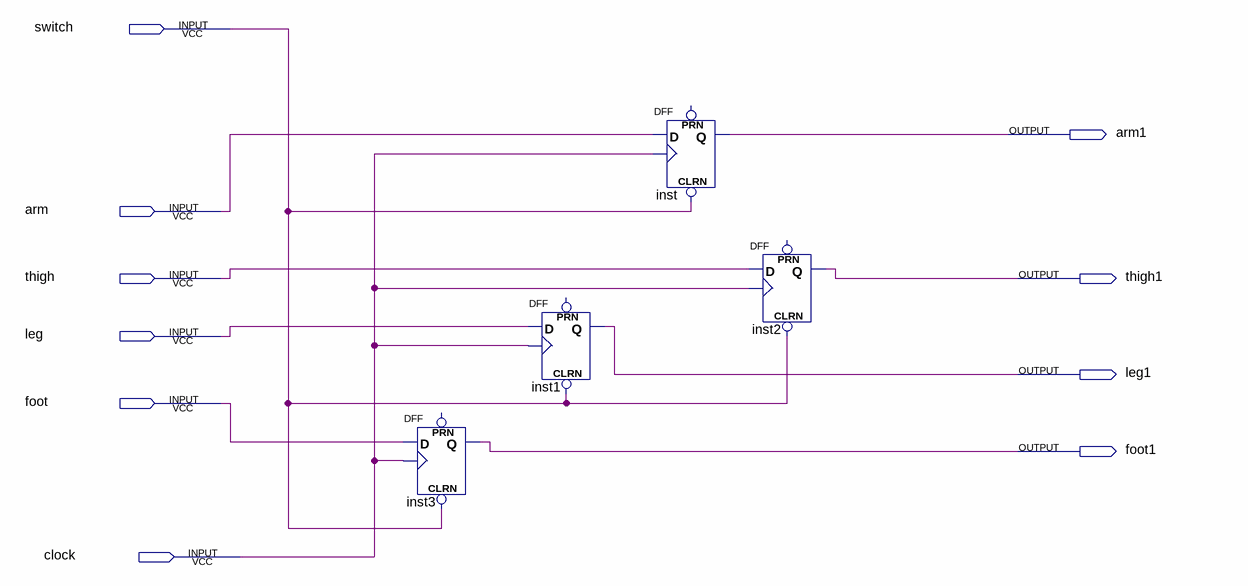
[diagram p0: schematic sheet]
// Quartus schematic legleg.bdf as structural Verilog: 4 symbols, 10 pins
module legleg (
  input  switch,
  input  arm,
  input  thigh,
  input  leg,
  input  foot,
  input  clock,
  output arm1,
  output thigh1,
  output leg1,
  output foot1
);

  DFF inst3 (.CLRN(switch), .CLK(clock), .D(foot), .Q(foot1));  // open: PRN
  DFF inst1 (.CLRN(switch), .CLK(clock), .D(leg), .Q(leg1));  // open: PRN
  DFF inst (.CLRN(switch), .CLK(clock), .D(arm), .Q(arm1));  // open: PRN
  DFF inst2 (.CLRN(switch), .CLK(clock), .D(thigh), .Q(thigh1));  // open: PRN
endmodule
